# Altium schematic sheet STM.SchDoc: Lab. Proj. PCB
size A4; Author: Tomasz Machnik; Revision: 1; SheetNumber: 1; SheetTotal: 1
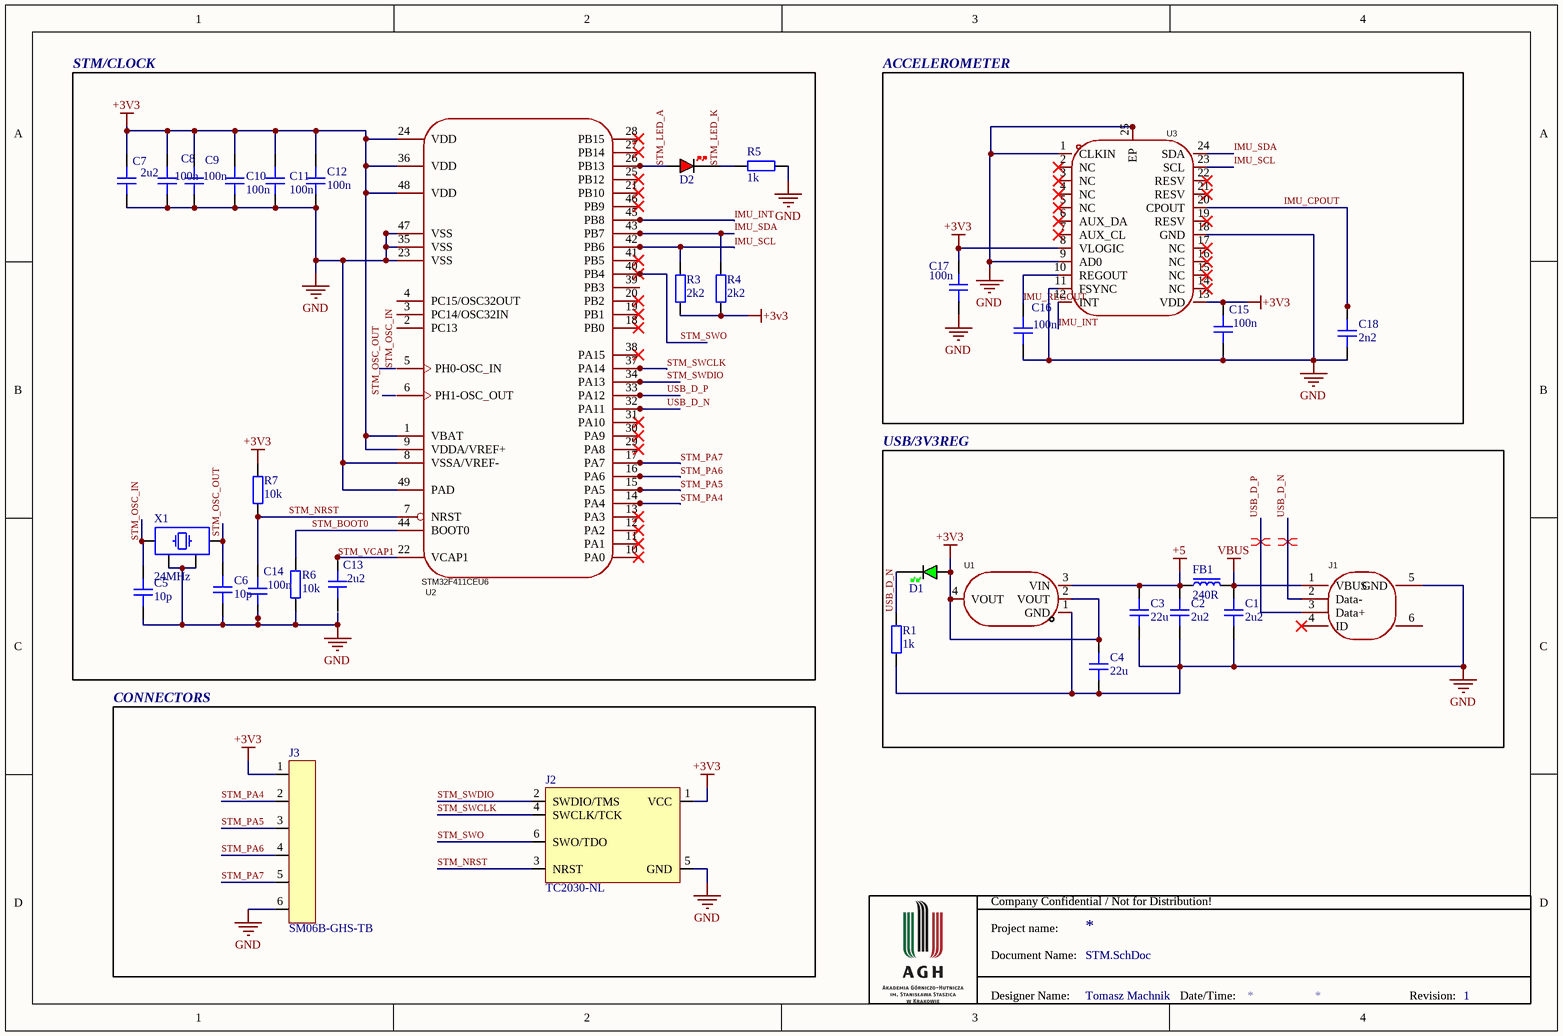
[diagram p0: STM.SchDoc]

## Parts
C1  2u2  [CAP_0603]
C2  2u2  [CAP_0603]
C3  22u  [CAP_0805]
C4  22u  [CAP_0805]
C5  10p  [CAP_0402]
C6  10p  [CAP_0402]
C7  2u2  [CAP_0603]
C8  100n  [CAP_0402]
C9  100n  [CAP_0402]
C10  100n  [CAP_0402]
C11  100n  [CAP_0402]
C12  100n  [CAP_0402]
C13  2u2  [CAP_0603]
C14  100n  [CAP_0402]
C15  100n  [CAP_0402]
C16  100n  [CAP_0402]
C17  100n  [CAP_0402]
C18  2n2  [CAP_0402]
D1  GREEN  [LED_0603_GREEN]  (value not drawn)
D2  RED  [LED_0402_RED]  (value not drawn)
FB1  240R  [FB_0603]
J1  473460001  [MICRO-USB-SMD_47346-0001]  (value not drawn)
J2  TC2030-NL  [TC2030-NL-FP]  (no BOM)
J3  SM06B-GHS-TB  [SM06B-GHS-TB]
R1  1k  [RES_0402]
R3  2k2  [RES_0402]
R4  2k2  [RES_0402]
R5  1k  [RES_0402]
R6  10k  [RES_0402]
R7  10k  [RES_0402]
U1  AMS1117-3.3  [SOT-223-3_L6.5-W3.4-P2.30-LS7.0-BR]  (value not drawn)
U2  STM32F411CEU6  [UFQFPN-48_L7.0-W7.0-P0.50-BL-EP]
U3  MPU-6050  [QFN-24_L4.0-W4.0-P0.50-BL-EP2.7]  (value not drawn)
X1  24MHz  [XTAL_3225]

## Blocks framed on the sheet
STM/CLOCK: C5-C14 D2 R3-R7 U2 X1
ACCELEROMETER: C15-C18 U3
USB/3V3REG: C1-C4 D1 FB1 J1 R1 U1
CONNECTORS: J2 J3

## Nets
+3V3: C4.1 C7.2 C8.2 C9.2 C10.2 C11.2 C12.2 C15.2 C17.2 D1.A J2.1(VCC) J3.1 R3.1 R4.1 R7.1 U1.2(VOUT) U1.4(VOUT) U2.1(VBAT) U2.9(VDDA/VREF+) U2.24(VDD) U2.36(VDD) U2.48(VDD) U3.8(VLOGIC) U3.13(VDD)
+5: C2.2 C3.1 FB1.1 U1.3(VIN)
GND: C1.1 C2.1 C3.2 C4.2 C5.2 C6.2 C12.1 C14.1 C15.1 C16.1 C17.1 C18.1 J1.5(GND) J2.5(GND) J3.6 R1.1 R5.2 R6.2 U1.1(GND) U2.8(VSSA/VREF-) U2.23(VSS) U2.35(VSS) U2.47(VSS) U2.49(PAD) U3.1(CLKIN) U3.9(AD0) U3.11(FSYNC) U3.18(GND) U3.25(EP) X1.2 X1.4
VBUS: C1.2 FB1.2 J1.1(VBUS)
IMU_CPOUT: C18.2 U3.20(CPOUT)
IMU_INT: U2.45(PB8) U3.12(INT)
IMU_REGOUT: C16.2 U3.10(REGOUT)
IMU_SCL: R3.2 U2.42(PB6) U3.23(SCL)
IMU_SDA: R4.2 U2.43(PB7) U3.24(SDA)
STM_BOOT0: R6.1 U2.44(BOOT0)
STM_LED_A: D2.A U2.26(PB13)
STM_LED_K: D2.K R5.1
STM_NRST: C14.2 J2.3(NRST) R7.2 U2.7(NRST)
STM_OSC_IN: C5.1 X1.1
STM_OSC_OUT: C6.1 X1.3
STM_PA4: J3.2 U2.14(PA4)
STM_PA5: J3.3 U2.15(PA5)
STM_PA6: J3.4 U2.16(PA6)
STM_PA7: J3.5 U2.17(PA7)
STM_SWCLK: J2.4(SWCLK/TCK) U2.37(PA14)
STM_SWDIO: J2.2(SWDIO/TMS) U2.34(PA13)
STM_SWO: J2.6(SWO/TDO) U2.40(PB4)
STM_VCAP1: C13.2 U2.22(VCAP1)
USB_D_N: D1.K J1.2(Data-) R1.2 U2.32(PA11)
USB_D_P: J1.3(Data+) U2.33(PA12)
NetC7_1: C7.1 C8.1 C9.1 C10.1 C11.1

Not connected (* = marked no-connect by the designer): C13 1; J1 4(ID)* 6; U2 2(PC13) 3(PC14/OSC32IN) 4(PC15/OSC32OUT) 5(PH0-OSC_IN) 6(PH1-OSC_OUT) 10(PA0) 11(PA1) 12(PA2) 13(PA3) 18(PB0) 19(PB1) 20(PB2) 21(PB10) 25(PB12) 27(PB14) 28(PB15) 29(PA8) 30(PA9) 31(PA10) 38(PA15) 39(PB3) 41(PB5) 46(PB9); U3 2(NC)* 3(NC)* 4(NC)* 5(NC)* 6(AUX_DA)* 7(AUX_CL)* 14(NC)* 15(NC)* 16(NC)* 17(NC)* 19(RESV)* 21(RESV)* 22(RESV)*

## Layout directives
differential pair; differential pair class DIFF_USB: USB_D_N, USB_D_P

## Notes on the sheet
- Company Confidential / Not for Distribution!
- Project name:
- Document Name:
- Designer Name:
- Date/Time:
- Revision:

## Library data of the parts
C1 C2 C7 C13 = CAP_0603: Capacitor SMD 0603; Manufacturer: *; Manufacturer Part Number: *; Distributor Link: *; LCSC: *; Rating: *; Dielectric: *
C3 C4 = CAP_0805: Capacitor SMD 0805; Manufacturer: *; Manufacturer Part Number: *; Distributor Link: *; LCSC: *; Rating: *; Dielectric: *
C5 C6 C8-C12 C14-C18 = CAP_0402: Capacitor SMD 0402; Manufacturer: *; Manufacturer Part Number: *; Distributor Link: *; LCSC: *; Rating: *; Dielectric: *
D1 = LED_0603_GREEN: LED 0603 GREEN SMD
D2 = LED_0402_RED: LED 0402 RED SMD
FB1 = FB_0603: Ferrite Bead SMD 0603; Manufacturer: *; Manufacturer Part Number: *; Distributor Link: *; LCSC: *
J1 = 473460001: Manufacturer: MOLEX; Symbol: 47346-0001; Add into BOM: yes; Connector Type: Micro-B; Gender: Female; Number of Ports: 1; Number of Contacts: 5P; Current Rating - Power (Max): 1A; Device: 473460001; LCSC Part Name: Micro-B 母; Supplier Part: C132560; Manufacturer Part: 473460001; Supplier Footprint: SMD; JLCPCB Part Class: Extended Part; Datasheet: https://atta.szlcsc.com/upload/public/pdf/source/20170925/C132560_1506321702749990501.pdf; Supplier: LCSC; Convert to PCB: yes; Standard: USB 2.0; Mounting Style: -; Contact Material: -; Contact Plating: -; Operating Temperature Range: -; Soldering Temperature(Max): -
J2 = TC2030-NL: Tag-Connect No-Solder SWD Debug Connector (No Legs) DO NOT PLACE; Manufacturer: Tag-Connect; Manufacturer Part Number: TC2030-NL-FP
J3 = SM06B-GHS-TB: Header Connector 6 Position 1.25MM Pitch SMD Horizontal JST GH; Manufacturer: JST; Manufacturer Part Number: SM06B-GHS-TB
R1 R3-R7 = RES_0402: Resistor SMD 0402; Manufacturer: *; Manufacturer Part Number: *; Distributor Link: *; LCSC: *
U1 = AMS1117-3.3_C6186: Manufacturer: AMS; Add into BOM: yes; Output Type: Fixed; Output Voltage: 3.3V; Output Current: 1A; Power Supply Rejection Ratio (PSRR): 72dB@(120Hz); Voltage Dropout: 1.3V@(800mA); Output Configuration: Positive electrode; Number of Outputs: 1; Symbol: AMS1117-3.3; Device: AMS1117-3.3_C6186; LCSC Part Name: 输出3.3V 1A; Supplier Part: C6186; Manufacturer Part: AMS1117-3.3; Supplier Footprint: SOT-223; JLCPCB Part Class: Basic Part; Datasheet: https://atta.szlcsc.com/upload/public/pdf/source/20180727/C6186_7A095716F0823C02F1997A905E26C086.pdf; Supplier: LCSC; Convert to PCB: yes; Voltage - Supply: -; standby current: -; Noise: -; Features: Overcurrent Protection(OCP)；热关断(TSD); Operating Temperature: -
U2 = STM32F411CEU6: Manufacturer: ST(意法半导体); Add into BOM: yes; CPU Core: ARM-M4; CPU Maximum Speed: 100MHz; Program Storage Size: 512KB; Program Memory Type: FLASH; Number of I/O: 36; ADC (Bit): 12bit; Low Voltage Detection Threshold: 1.7V~3.6V; Symbol: STM32F411CEU6; Device: STM32F411CEU6; LCSC Part Name: 带DSP和FPU的高性能基本型系列ARM Cortex-M4 MCU，具有512 KB Flash、100 MHz CPU和ART加速器; Supplier Part: C60420; Manufacturer Part: STM32F411CEU6; Supplier Footprint: UFQFPN-48(7x7); JLCPCB Part Class: Extended Part; Datasheet: https://atta.szlcsc.com/upload/public/pdf/source/20151026/1457707507170.pdf; Supplier: LCSC; Convert to PCB: yes; Application Area: -
U3 = MPU-6050: Manufacturer: TDK InvenSense(应美盛); Symbol: MPU-6050_C24112; Add into BOM: yes; Sensor Type: 加速度计陀螺仪; Device: MPU-6050; LCSC Part Name: MPU-6050; Supplier Part: C24112; Manufacturer Part: MPU-6050; Supplier Footprint: QFN-24-EP(4x4); JLCPCB Part Class: Extended Part; Datasheet: https://atta.szlcsc.com/upload/public/pdf/source/20140425/1457707046159.pdf; Supplier: LCSC; Convert to PCB: yes; Operating Temperature: -40℃~+85℃
X1 = TSX-3225_24.0000MF15X-AC: Crystal SMD 24MHz 10PPM 7pF 3225; Manufacturer: Epson; Manufacturer Part Number: TSX-3225 24.0000MF15X-AC